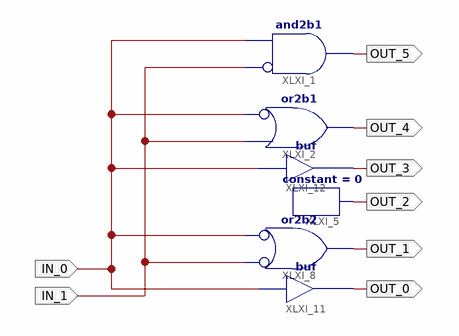
[diagram p0: schematic sheet 1]
// Xilinx ISE schematic lab1.sch (spartan3a) as structural Verilog: 6 symbols, 8 ports
module lab1 (
  input  IN_0,
  input  IN_1,
  output OUT_0,
  output OUT_1,
  output OUT_2,
  output OUT_3,
  output OUT_4,
  output OUT_5
);

  and XLXI_1 (OUT_5, ~IN_1, IN_0);  // and2b1
  or XLXI_2 (OUT_4, ~IN_0, IN_1);  // or2b1
  constant #(.CValue("0")) XLXI_5 (.O(OUT_2));
  or XLXI_8 (OUT_1, ~IN_1, ~IN_0);  // or2b2
  buf XLXI_11 (OUT_0, IN_0);
  buf XLXI_12 (OUT_3, IN_0);
endmodule
